# EAGLE design snap_shield (EAGLE 5.10)
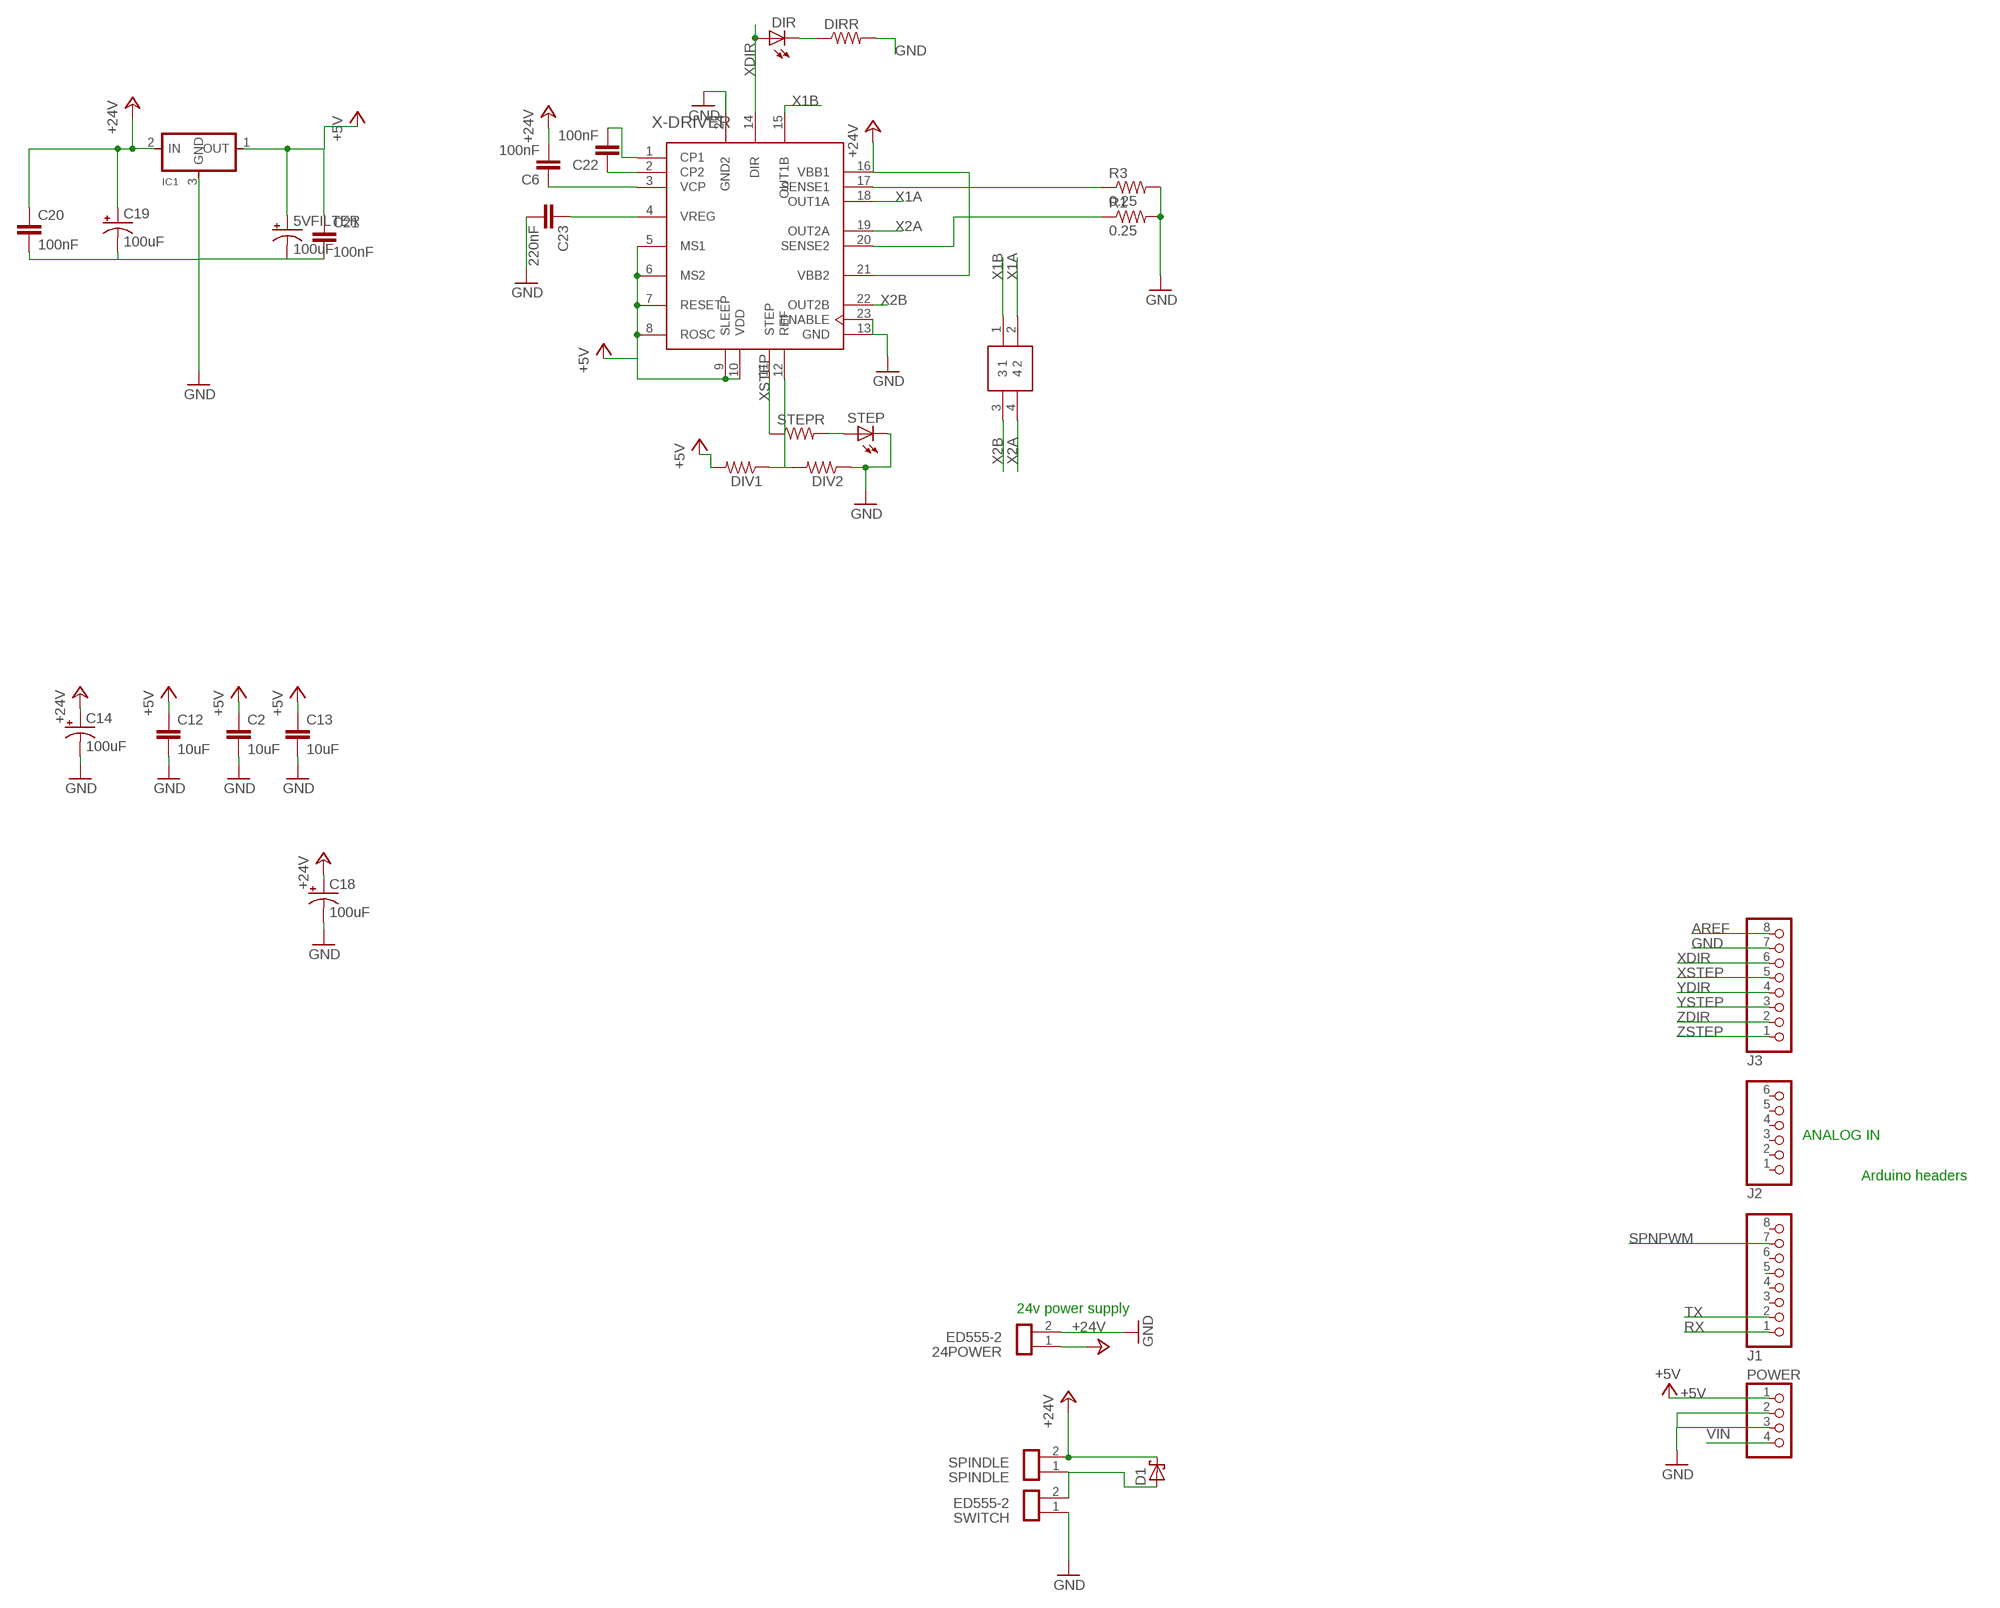
[diagram p0: schematic, sheet 1]

## Parts
5VFILTER  100uF  CPOL-USUD-10X10  [UD-10X10_NICHICON]
24POWER  ED555-2  [ED555-2]
C2  10uF  C-EUC1206K  [C1206K]
C6  100nF  C-EUC1206  [C1206]
C12  10uF  C-EUC1206K  [C1206K]
C13  10uF  C-EUC1206K  [C1206K]
C14  100uF  CPOL-USUD-10X10  [UD-10X10_NICHICON]
C18  100uF  CPOL-USUD-10X10  [UD-10X10_NICHICON]
C19  100uF  CPOL-USUD-10X10  [UD-10X10_NICHICON]
C20  100nF  C-EUC1206K  [C1206K]
C21  100nF  C-EUC1206K  [C1206K]
C22  100nF  C-EUC1206  [C1206]
C23  220nF  C-EUC1206  [C1206]
D1  SCHOTTKY-DIODESMC  [SMC]
DIR  LED1206  [1206]
DIRR  RESISTOR1206  [1206]
DIV1  RESISTOR1206  [1206]
DIV2  RESISTOR1206  [1206]
IC1  REGULATORSOT23  [SOT23]
J1  PINHD-1X8  [1X08]
J2  PINHD-1X6  [1X06]
J3  PINHD-1X8  [1X08]
POWER  PINHD-1X4  [1X04]
R1  0.25  R-US_R2512  [R2512]
R3  0.25  R-US_R2512  [R2512]
SPINDLE  SPINDLE  ED555-2  [ED555-2]
STEP  LED1206  [1206]
STEPR  R-US_R1206  [R1206]
SWITCH  ED555-2  [ED555-2]
U$3  4-HEADER  [4PIN-HEADER]
X-DRIVER  A3983A3983  [TSSOP24]

## Nets
+5V [Power]: 5VFILTER.+ C2.1 C12.1 C13.1 C21.1 DIV1.2 IC1.1(OUT) POWER.1 X-DRIVER.5(MS1) X-DRIVER.6(MS2) X-DRIVER.7(RESET) X-DRIVER.8(ROSC) X-DRIVER.9(SLEEP) X-DRIVER.10(VDD)
+24V: 24POWER.1 C6.2 C14.+ C18.+ C19.+ C20.1 D1.C IC1.2(IN) SPINDLE.2 X-DRIVER.16(VBB1) X-DRIVER.21(VBB2)
AREF [Power]: J3.8
GND [Power]: 5VFILTER.- 24POWER.2 C2.2 C12.2 C13.2 C14.- C18.- C19.- C20.2 C21.2 C23.2 DIRR.2 DIV2.1 IC1.3(GND) J3.7 POWER.2 POWER.3 R1.2 R3.2 STEP.2(C) SWITCH.1 X-DRIVER.13(GND) X-DRIVER.23(ENABLE) X-DRIVER.24(GND2)
N$1: D1.A SPINDLE.1 SWITCH.2
N$2: DIR.2(C) DIRR.1
N$3: STEP.1(A) STEPR.2
N$5: C22.1 X-DRIVER.2(CP2)
N$6: C22.2 X-DRIVER.1(CP1)
N$8: R3.1 X-DRIVER.17(SENSE1)
N$18: DIV1.1 DIV2.2 X-DRIVER.12(REF)
N$19: C6.1 X-DRIVER.3(VCP)
N$21: J1.5
N$23: R1.1 X-DRIVER.20(SENSE2)
N$24: C23.1 X-DRIVER.4(VREG)
RX: J1.1
SPNPWM: J1.7
TX: J1.2
VIN [Power]: POWER.4
X1A: U$3.2 X-DRIVER.18(OUT1A)
X1B: U$3.1 X-DRIVER.15(OUT1B)
X2A: U$3.4 X-DRIVER.19(OUT2A)
X2B: U$3.3 X-DRIVER.22(OUT2B)
XDIR: DIR.1(A) J3.6 X-DRIVER.14(DIR)
XSTEP: J3.5 STEPR.1 X-DRIVER.11(STEP)
YDIR: J3.4
YSTEP: J3.3
ZDIR: J3.2
ZSTEP: J3.1
Unconnected: J1.3 J1.4 J1.6 J1.8 J2.1 J2.2 J2.3 J2.4 J2.5 J2.6

## Notes on the sheet
- ANALOG IN
- Arduino headers
- 24v power supply

## Library data of the parts
5VFILTER C14 C18 C19 = rcl:CPOL-US: POLARIZED CAPACITOR, American symbol
24POWER SPINDLE SWITCH = ADS:ED555-2
C2 C6 C12 C13 C20-C23 = rcl:C-EU: CAPACITOR, European symbol
D1 = diode:SCHOTTKY-DIODE: Schottky Diode
DIR STEP = ng:LED
DIRR DIV1 DIV2 = ng:RESISTOR
IC1 = ng:REGULATOR
J1 J3 = pinhead:PINHD-1X8: PIN HEADER
J2 = pinhead:PINHD-1X6: PIN HEADER
POWER = pinhead:PINHD-1X4: PIN HEADER
R1 R3 = rcl:R-US_: RESISTOR, American symbol
STEPR = resistor:R-US_: RESISTOR, American symbol
U$3 = header_new:4-HEADER
X-DRIVER = AAA:A3983

## Net classes
0 default: width 0.381 mm
1 Power: width 0.635 mm, drill 0.381 mm, clearance 0.508 mm

## Board
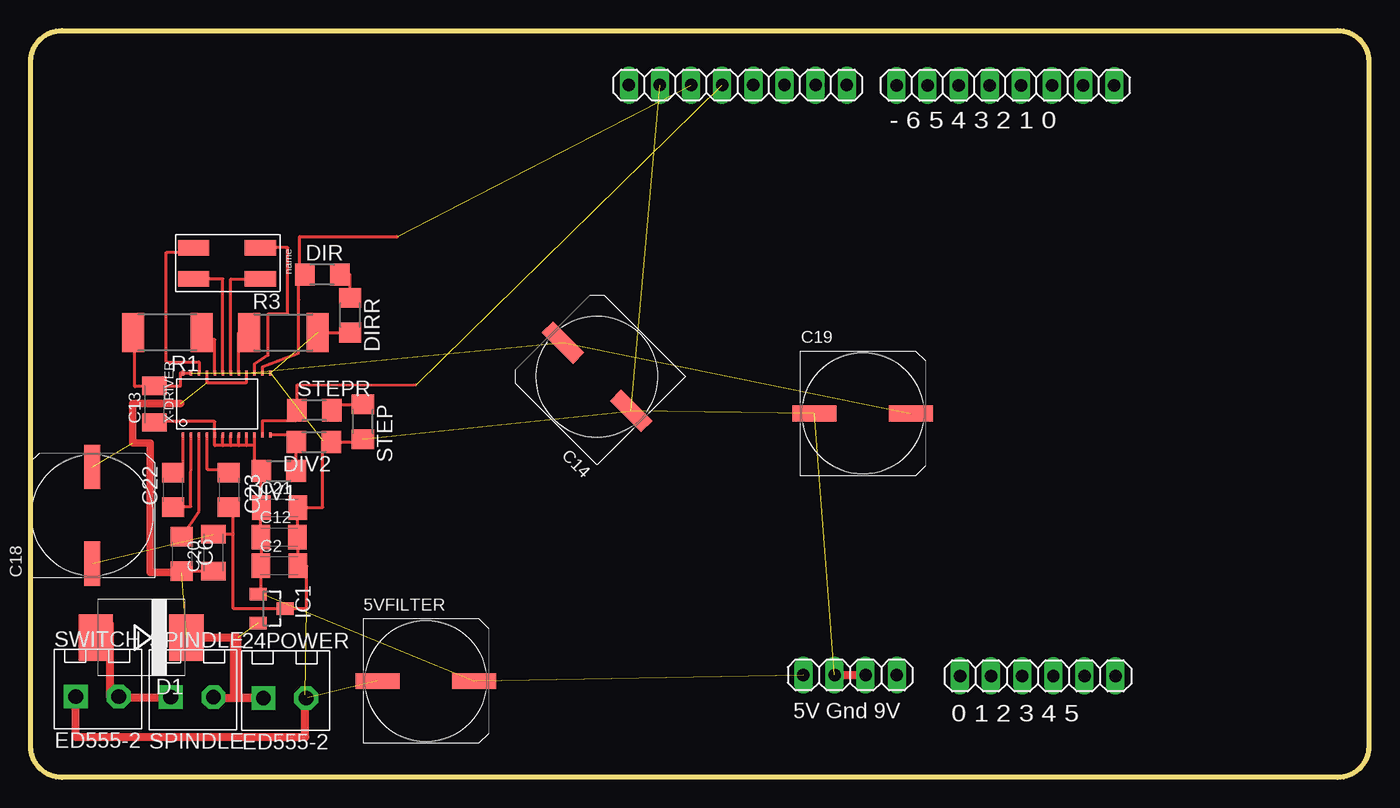
[diagram p1: board, top side]

Size 109.22 x 60.96 mm. Coordinates in mm from the lower left corner, seen from the top.
Outline: 2.54,60.96 106.68,60.96 arc-90 109.22,58.42 109.22,2.54 arc-90 106.68,0 2.54,0 arc-90 0,2.54 0,58.42 arc-90 2.54,60.96
Copper layers (1*16): Top 0.035mm / dielectric 1.5mm / Bottom 0.035mm
Design rules "default": minimum track width 8mil, minimum drill 16mil, track to track 8mil, track to pad 8mil, pad to pad 8mil, via to via 12mil, smd to smd 8mil, copper to edge 30mil, drill to drill 10mil, minimum pad ring 10mil, minimum via ring 12mil, stop-mask expansion 4mil, vias tented up to drill 0mil, thermal gap 10mil

### Footprints (pad centres in the part's own frame; a part is rotated, then mirrored left to right if it is on the bottom)
UD-10X10_NICHICON = smd 3.6 x 1.3: + 3.925,0; - -3.95,0
ED555-2 = drill 1.194 pad 1.93 square: 1 1.27,1.27 | drill 1.194 pad 1.93 octagon: 2 4.77,1.27
C1206K = smd 1.5 x 2: 1 -1.5,0; 2 1.5,0
C1206 = smd 1.6 x 1.8: 1 -1.4,0; 2 1.4,0
SMC = smd 2.8 x 3.8: A 3.7,0; C -3.7,0
1206 = smd 1.6 x 1.803: 1 -1.422,0; 2 1.422,0
SOT23 = smd 1 x 1.4: 1 -1.179,-1.125; 2 1.179,-1.125; 3 0,1.1
1X08 = drill 1.016 long: 1 -8.89,0; 2 -6.35,0; 3 -3.81,0; 4 -1.27,0; 5 1.27,0; 6 3.81,0; 7 6.35,0; 8 8.89,0
1X06 = drill 1.016 long: 1 -6.35,0; 2 -3.81,0; 3 -1.27,0; 4 1.27,0; 5 3.81,0; 6 6.35,0
1X04 = drill 1.016 long: 1 -3.81,0; 2 -1.27,0; 3 1.27,0; 4 3.81,0
R2512 = smd 1.8 x 3.2: 1 -2.8,0; 2 2.8,0
R1206 = smd 1.6 x 1.803: 1 -1.422,0; 2 1.422,0
4PIN-HEADER = smd 1.27 x 2.54: 1 -1.27,2.73; 2 1.27,2.73; 3 -1.27,-2.73; 4 1.27,-2.73
TSSOP24 = smd 0.203 x 0.406: 1 -2.794,-2.54; 2 -2.146,-2.54; 3 -1.499,-2.54; 4 -0.851,-2.54; 5 -0.203,-2.54; 6 0.445,-2.54; 7 1.092,-2.54; 8 1.74,-2.54; 9 2.388,-2.54; 10 3.035,-2.54; 11 3.683,-2.54; 12 4.331,-2.54; 13 4.331,2.54; 14 3.683,2.54; 15 3.035,2.54; 16 2.388,2.54; 17 1.74,2.54; 18 1.092,2.54; 19 0.445,2.54; 20 -0.203,2.54; 21 -0.851,2.54; 22 -1.499,2.54; 23 -2.146,2.54; 24 -2.794,2.54

### Placement (x,y rotation side)
5VFILTER  32.26,7.86 0 top
24POWER  17.72,5.21 0 top
C2  20.31,17.27 0 top
C6  12.34,18.24 270 top
C12  20.28,19.62 0 top
C13  10.11,30.47 90 top
C14  46.22,32.71 135 top
C18  5.03,21.4 90 top
C19  67.93,29.72 0 top
C20  14.91,18.34 90 top
C21  20.32,22 0 top
C22  11.63,23.47 90 top
C23  16.18,23.47 270 top
D1  9.02,11.4 180 top
DIR  23.81,41.05 0 top
DIRR  26.07,37.73 270 top
DIV1  20.24,25.02 180 top
DIV2  23.11,27.38 180 top
IC1  19.68,13.78 270 top
J1  79.55,56.49 180 top
J2  82.2,8.28 0 top
J3  57.71,56.51 180 top
POWER  66.88,8.36 0 top
R1  11.18,36.32 180 top
R3  20.62,36.32 0 top
SPINDLE  10.16,5.27 0 top
STEP  27.11,29.03 270 top
STEPR  23.15,29.97 0 top
SWITCH  2.41,5.33 0 top
U$3  16.03,41.96 270 top
X-DRIVER  15.24,30.48 0 top

### Tracks (layer width: path | path; a pad name or v marks a point on that pad's centre or on a via)
+5V  (2 unrouted)
  Top 0.229: 18.27,27.08 18.27,25.02 DIV1.2 18.82,22.12 C21.1 18.78,21.95 C12.1 | 18.27,27.08 X-DRIVER.10 | 15.68,27.08 15.04,27.08 X-DRIVER.5 15.04,29.03 11.84,29.03 10.64,29.06 C13.1 | 16.33,27.08 15.68,27.08 | 16.98,27.08 16.33,27.08 | 17.63,27.08 16.98,27.08 | 18.27,27.08 17.63,27.08 | 15.68,27.08 X-DRIVER.6 | 16.33,27.08 X-DRIVER.7 | 16.98,27.08 X-DRIVER.8 | 17.63,27.08 X-DRIVER.9 | C12.1 18.38,19.47 | C2.1 18.78,17.25 | C12.1 18.88,19.67 C2.1 | C2.1 18.92,17.25 | 18.56,14.99 18.38,14.99 | 18.81,14.99 18.92,14.99 | 18.81,14.99 C2.1 | 18.56,14.99 18.81,14.99 | IC1.1 18.56,14.99
+24V  (6 unrouted)
  Top 0.229: X-DRIVER.21 14.39,32.23 17.63,32.23 X-DRIVER.16 | C6.2 11.61,16.84 C20.1 13.92,16.84
  Top 0.61: 12.24,30.5 8.32,30.5 8.32,27.28 9.75,27.28 9.75,16.73 12.34,16.73 C6.2
  Top 0.635: SPINDLE.2 14.93,6.48 16.89,6.48 | 12.57,11.41 D1.C 16.57,11.41 | 16.89,6.48 24POWER.1 16.57,6.48 16.57,11.41 | 16.57,11.41 16.89,11.41 16.89,6.48
GND  (10 unrouted)
  Top 0.229: X-DRIVER.23 X-DRIVER.24 12.24,33.02 12.24,31.93 10.11,31.93 C13.2 10.11,31.9 8.51,31.9 8.51,36.32 R1.2 | C23.2 16.54,22.07 16.54,19.84 | 16.54,19.84 C20.2 | 16.54,19.84 16.54,13.78 IC1.3 20.79,13.8 22.54,13.8 22.54,17.25 21.5,17.25 C2.2 21.88,19.67 C12.2 21.78,21.95 C21.2 21.74,22.05 23.85,22.05 23.85,27.48 DIV2.1 27.11,27.38 STEP.2 | DIRR.2 R3.2
  Top 0.305: POWER.2 65.6,8.36
  Top 0.635: POWER.2 POWER.3 | 22.61,6.48 24POWER.2 22.41,6.48 | 3.56,6.6 SWITCH.1 3.68,3.3 22.41,3.3 22.41,6.48 | 22.48,6.73 22.41,6.73 22.41,6.48
N$1
  Top 0.635: D1.A 5.57,12.55 6.48,12.52 6.48,6.58 SWITCH.2 7.18,6.54 SPINDLE.1
N$2
  Top 0.229: DIR.2 26.07,41.05 DIRR.1
N$3
  Top 0.229: STEP.1 24.55,30.45 STEPR.2
N$5
  Top 0.229: X-DRIVER.2 13.09,27.93 13.08,22.1 11.63,22.1 C22.1
N$6
  Top 0.229: X-DRIVER.1 12.45,25.48 11.63,25.48 C22.2
N$8
  Top 0.229: R3.1 16.98,36.32 X-DRIVER.17
N$18
  Top 0.229: DIV1.1 21.67,27.48 DIV2.2 21.64,27.94 X-DRIVER.12
N$19
  Top 0.229: X-DRIVER.3 13.74,21.77 C6.1
N$23
  Top 0.229: X-DRIVER.20 15.04,35.74 13.98,35.74 R1.1
N$24
  Top 0.229: X-DRIVER.4 14.39,25.15 16.2,25.15 C23.1
X1A
  Top 0.229: U$3.2 16.33,40.69 X-DRIVER.18
X1B
  Top 0.229: U$3.1 20.98,43.23 20.98,37.85 19.41,37.85 19.41,34.47 18.27,33.76 X-DRIVER.15
X2A
  Top 0.229: U$3.4 15.68,40.69 X-DRIVER.19
X2B
  Top 0.229: U$3.3 13.64,43.23 13.64,42.88 11.07,42.88 11.07,33.91 13.74,33.91 X-DRIVER.22
XDIR  (1 unrouted)
  Top 0.229: X-DRIVER.14 18.92,33.53 21.41,34.47 21.87,34.62 21.88,39 21.88,40.3 DIR.1 21.97,41.05 21.97,44.14 29.9,44.14 29.9,44.08
XSTEP  (1 unrouted)
  Top 0.229: X-DRIVER.11 18.92,29.12 21.67,29.12 STEPR.1 21.73,29.72 21.75,32.07 31.45,32.03

### Text on the board
tNames: - 6 5 4 3 2 1 0 | 5V Gnd 9V | 0 1 2 3 4 5